# Altium project stm32f7board.PrjPcb (part 3 of 3)

## Sheet USB_OTG_HS_PHY.SchDoc
size A
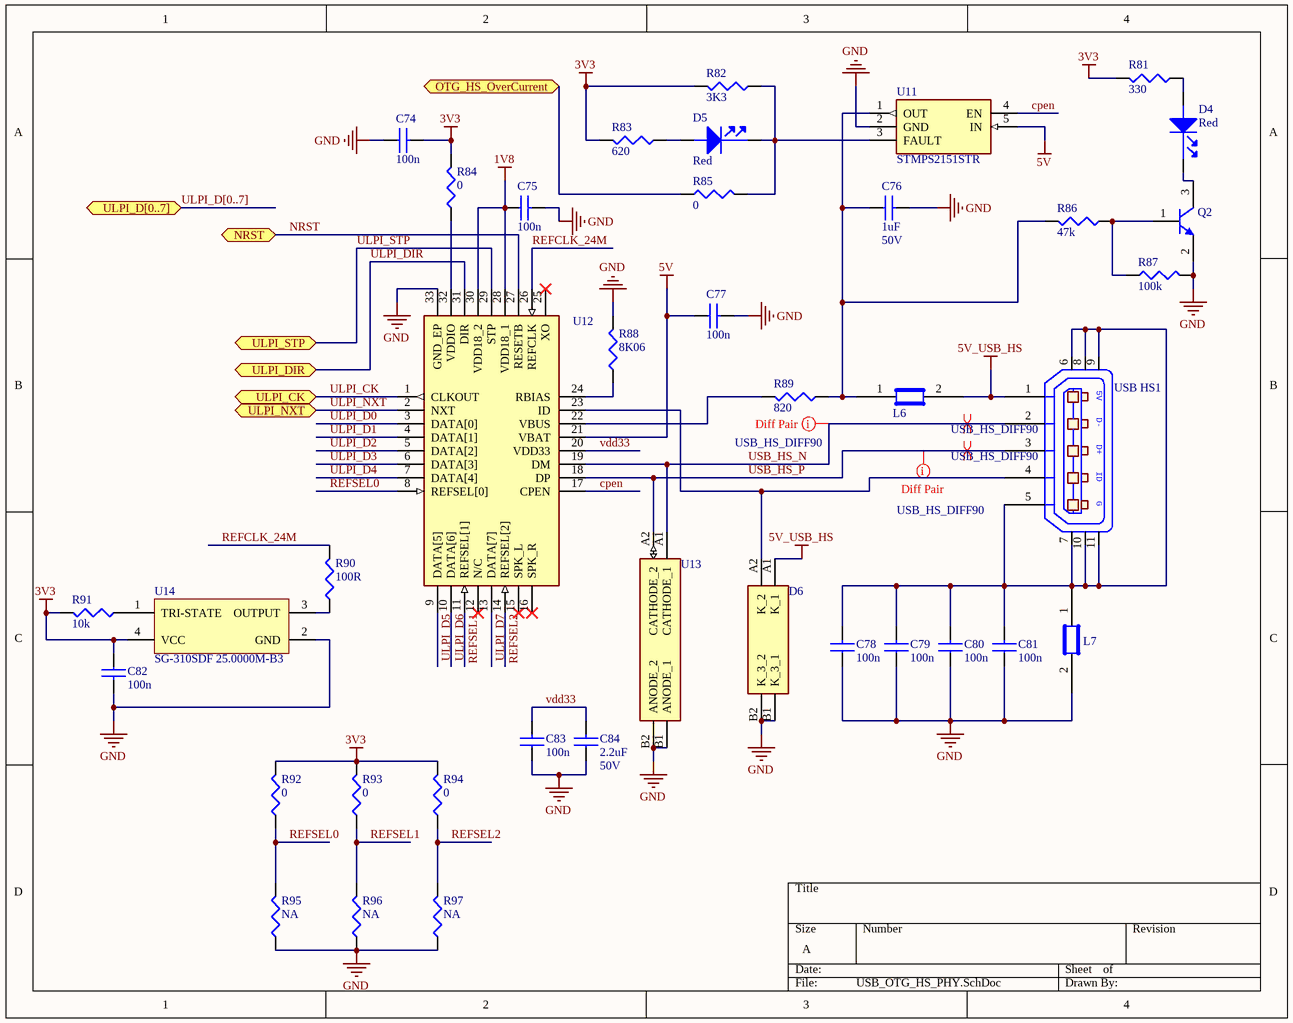
[diagram p11: USB_OTG_HS_PHY.SchDoc]

### Parts
C74  100n  [C0402]
C75  100n  [C0402]
C76  1uF  Voltage - Rated: 50V  [C0805]
C77  100n  [C0402]
C78  100n  [C0402]
C79  100n  [C0402]
C80  100n  [C0402]
C81  100n  [C0402]
C82  100n  [C0402]
C83  100n  [C0402]
C84  2.2uF  Voltage - Rated: 50V  [C0805]
D4  Red  [LED_0603]
D5  Red  [LED_0603]
D6  ESDA14V2-2BF3  [BGA4C40P2X2_77X77X66]  (value not drawn)
L6  MPZ1608S601A 600OHM/1A  [C0603]  (value not drawn)
L7  MPZ1608S601A 600OHM/1A  [C0603]  (value not drawn)
Q2  MMBT2222A-7-F  [DIOD-SOT23-3_V]  (value not drawn)
R81  330  [R0402]
R82  3K3  [R0402]
R83  620  [R0402]
R84  0  [R0402]
R85  0  [R0402]
R86  47k  [R0402]
R87  100k  [R0402]
R88  8K06  [R0402]
R89  820  [R0402]
R90  100R  [R0402]
R91  10k  [R0402]
R92  0  [R0402]
R93  0  [R0402]
R94  0  [R0402]
R95  NA  [R0402]
R96  NA  [R0402]
R97  NA  [R0402]
U11  STMPS2151STR  [SOT95P280X145-5N]
U12  USB3320C-EZK-TR  [QFN50P500X500X100-33N-D]  (value not drawn)
U13  USBULC6-2F3  [BGA4C40P2X2_82X82X66]  (value not drawn)
U14  SG-310SDF 25.0000M-B3  [EPSON-SG-310-4_V]
USB_HS1  USB MICRO AB  [USB_Micro_AB]  (value not drawn)

### Ports
NRST (bidir), OTG_HS_OverCurrent (bidir), ULPI_CK (bidir), ULPI_D[0..7] (bidir), ULPI_DIR (bidir), ULPI_NXT (bidir), ULPI_STP (bidir)

### Nets
1V8: C75.1 U12.28(VDD18_1) U12.30(VDD18_2)
3V3: C74.2 C82.1 R81.2 R82.2 R83.2 R84.2 R91.2 R92.2 R93.2 R94.2 U14.4(VCC)
5V: C77.1 U11.5(IN) U12.21(VBAT)
5V_USB_HS: D6.A1(K_1) L6.2 USB_HS1.1(P1)
GND: C74.1 C75.2 C76.2 C77.2 C78.1 C79.1 C80.1 C81.1 C82.2 C83.1 C84.1 D6.B1(K_3_1) D6.B2(K_3_2) L7.2 Q2.2(E) R87.2 R88.2 R95.1 R96.1 R97.1 U11.2(GND) U12.33(GND_EP) U13.B1(ANODE_1) U13.B2(ANODE_2) U14.2(GND)
cpen: U11.4(EN) U12.17(CPEN)
NRST: U12.27(RESETB) ; port NRST  [project net DCMI_NRST]
OTG_HS_OverCurrent: R85.1 ; port OTG_HS_OverCurrent
REFCLK_24M: R90.2 U12.26(REFCLK)
REFSEL0: R92.1 R95.2 U12.8(REFSEL[0])
REFSEL1: R93.1 R96.2 U12.11(REFSEL[1])
REFSEL2: R94.1 R97.2 U12.14(REFSEL[2])
ULPI_CK: U12.1(CLKOUT) ; port ULPI_CK
ULPI_D0: U12.3(DATA[0])
ULPI_D1: U12.4(DATA[1])
ULPI_D2: U12.5(DATA[2])
ULPI_D3: U12.6(DATA[3])
ULPI_D4: U12.7(DATA[4])
ULPI_D5: U12.9(DATA[5])
ULPI_D6: U12.10(DATA[6])
ULPI_D7: U12.13(DATA[7])
ULPI_DIR: U12.31(DIR) ; port ULPI_DIR
ULPI_NXT: U12.2(NXT) ; port ULPI_NXT
ULPI_STP: U12.29(STP) ; port ULPI_STP
USB_HS_N: U12.19(DM) U13.A1(CATHODE_1) USB_HS1.2(P2)
USB_HS_P: U12.18(DP) U13.A2(CATHODE_2) USB_HS1.3(P3)
vdd33: C83.2 C84.2 U12.20(VDD33)
NetC76_1: C76.1 L6.1 R86.2 R89.1 U11.1(OUT)
NetC78_2: C78.2 C79.2 C80.2 C81.2 L7.1 USB_HS1.5(P5) USB_HS1.6 USB_HS1.7 USB_HS1.8 USB_HS1.9 USB_HS1.10 USB_HS1.11
NetD4_1: D4.1(cathode) Q2.3(C)
NetD4_2: D4.2(ANODE) R81.1
NetD5_1: D5.1(cathode) R82.1 R85.2 U11.3(FAULT)
NetD5_2: D5.2(ANODE) R83.1
NetD6_A2: D6.A2(K_2) U12.23(ID) USB_HS1.4(P4)
NetQ2_1: Q2.1(B) R86.1 R87.1
NetR84_1: R84.1 U12.32(VDDIO)
NetR88_1: R88.1 U12.24(RBIAS)
NetR89_2: R89.2 U12.22(VBUS)
NetR90_1: R90.1 U14.3(OUTPUT)
NetR91_1: R91.1 U14.1(TRI-STATE)

Not connected (* = marked no-connect by the designer): U12 12(N/C)* 15(SPK_L)* 16(SPK_R)* 25(XO)*

### Buses and harness runs
bus ULPI_D[0..7] = port ULPI_D[0..7]

### Layout directives
differential pair; differential pair class USB_HS_DIFF90: USB_HS_N, USB_HS_P
net class USB_HS_DIFF90: USB_HS_N, USB_HS_P

### Notes on the sheet
- (in symbol 0475890001) 5V; D-; D+; ID; G

### Library data of the parts
C74 C75 C77-C83 = C1005X5R1H104K: CAP CER .10UF 50V X5R 10% 0402; Manufacturer: TDK Corporation; Capacitance: 0.1µF; Value: 100nF; .Checked PCB: used; Category: Capacitors; Supplier Part Number: 445-5942-1-ND; Manufacturer Part Number: C1005X5R1H104K; Operating Temperature: -55°C ~ 85°C; Package / Case: 0402 (1005 Metric); Price 1k [$]: 0.02340; .Checked SCH: used; Voltage - Rated: 50V; Supplier: Digikey; Supplier 1: Digi-Key; Supplier Part Number 1: 445-5942-1-ND; RoHS: RoHS Compliant; Stock 1: 106926; Pricing 1: 1=0.27, 10=0.18, 100=0.072, 250=0.05176, 500=0.0369, 1000=0.027 (USD); Tolerance: ±10%; Temperature Coefficient: X5R; Mounting Type: Surface Mount, MLCC; Applications: General Purpose; Ratings: -; Size / Dimension: 0.039" L x 0.020" W (1.00mm x 0.50mm); Height - Seated (Max): -; Thickness (Max): 0.022" (0.55mm); Lead Spacing: -; Features: -; Packaging: Cut Tape (CT); Lead Style: -; ComponentLink1URL: http://www.tdk.co.jp/tefe02/e412_c.pdf; ComponentLink1Description: http://www.tdk.co.jp/tefe02/e412_c.pdf
C76 C84 = GRM21BR71H105KA12L: CAP CER 1UF 50V X7R 0805; Manufacturer: Murata Electronics North America; Capacitance: 1.0µF; .Checked PCB: used; Tolerance: ±10%; Category: Capacitors; Manufacturer Part Number: GRM21BR71H105KA12L; Operating Temperature: -55°C ~ 125°C; Package / Case: 0805 (2012 Metric); Price 1k [$]: 0.1359; Value: 1uF; .Checked SCH: used; Supplier Part Number: 490-4736-1-ND; Supplier: Digikey; Supplier 1: Digi-Key; Supplier Part Number 1: 490-4736-1-ND; RoHS: RoHS Compliant; Stock 1: 422791; Pricing 1: 1=0.28, 10=0.254, 25=0.226, 50=0.1978, 100=0.1836, 250=0.16952, 500=0.16102, 750=0.14691, 1000=0.12995 (USD); Temperature Coefficient: X7R; Mounting Type: Surface Mount, MLCC; Applications: General Purpose; Ratings: -; Size / Dimension: 0.079" L x 0.049" W (2.00mm x 1.25mm); Height - Seated (Max): -; Thickness (Max): 0.053" (1.35mm); Lead Spacing: -; Features: -; Packaging: Cut Tape (CT); Lead Style: -; ComponentLink1URL: http://search.murata.co.jp/Ceramy/image/img/PDF/ENG/GRM21BR71H105KA12.pdf; ComponentLink1Description: http://search.murata.co.jp/Ceramy/image/img/PDF/ENG/GRM21BR71H105KA12.pdf
D4 D5 = LS L29K-H1J2-1-Z: LED SMARTLED RED 630NM 0603 SMD; Manufacturer: OSRAM Opto Semiconductors Inc; Millicandela Rating: 4.95mcd; Voltage - Forward (Vf) Typ: 1.8V; Current - Test: 2mA; Wavelength - Peak: 643nm; Viewing Angle: 160°; Lens Type: Diffused; Lens Style/Size: Rectangle with Flat Top, 1.3mm x 0.8mm; Luminous Flux @ Current - Test: 20 mlm; .Checked PCB: RF; Supplier 1: Digi-Key; Supplier Part Number 1: 475-1195-1-ND; Manufacturer Part Number: LS L29K-H1J2-1-Z; RoHS: RoHS Compliant; Category: Optoelectronics; Stock 1: 71670; Pricing 1: 1=0.16, 10=0.137, 100=0.1093, 250=0.09564, 500=0.08744 (USD); Color: Red; Wavelength - Dominant: 630nm; Package / Case: 0603 (1608 Metric); Size / Dimension: 1.70mm L x 0.80mm W; Height: 0.65mm; Mounting Type: Surface Mount; Packaging: Cut Tape (CT); ComponentLink1URL: http://catalog.osram-os.com/catalogue/catalogue.do;jsessionid=DB7CFDBAC5AF1E216E45F622E867085A?act=downloadFile&favOid=020000010003f9de000100b6; ComponentLink1Description: http://catalog.osram-os.com/catalogue/catalogue.do;jsessionid=DB7CFDBAC5AF1E216E45F622E867085A?act=downloadFile&favOid=020000010003f9de000100b6; .Checked SCH: RF
D6 = ESDA14V2-2BF3: TVS Diode (Bi-directional); Manufacturer_Name: STMicroelectronics; Datasheet Link: https://mouser.componentsearchengine.com/Datasheets/1/ESDA14V2-2BF3.pdf; Height: 0.66mm; Manufacturer_Part_Number: ESDA14V2-2BF3; Mouser Part Number: 511-ESDA14V2-2BF3; Mouser Price/Stock: https://www.mouser.com/Search/Refine.aspx?Keyword=511-ESDA14V2-2BF3
L6 L7 = MPZ1608S601A: FERRITE CHIP BEAD 600 OHM SMD 1A; Manufacturer: TDK Corporation; Impedance @ Frequency: 600 Ohm @ 100MHz; DC Resistance (DCR): 150 mOhm Max; Filter Type: Differential Mode - Single; Number of Lines: 1; .Checked PCB: RF; Supplier 1: Digi-Key; Supplier Part Number 1: 445-2205-1-ND; Manufacturer Part Number: MPZ1608S601A; RoHS: RoHS Compliant; Category: Filters; Stock 1: 328345; Pricing 1: 1=0.36, 10=0.24, 100=0.096, 250=0.069, 500=0.0492, 1000=0.036 (USD); Current Rating: 1A; Package / Case: 0603 (1608 Metric); Mounting Type: Surface Mount; Packaging: Cut Tape (CT); Height (Max): 0.037" (0.95mm); Size / Dimension: 0.063" L x 0.031" W (1.60mm x 0.80mm); ComponentLink1URL: http://www.tdk.co.jp/tefe02/e9413_mpz.pdf; ComponentLink1Description: http://www.tdk.co.jp/tefe02/e9413_mpz.pdf; .Checked SCH: RF
Q2 = CMP-1693-00003-1: NPN Small Signal Transistor, 40 V, -55 to 150 degC, 3-Pin SOT23, RoHS, Tape and Reel; Manufacturer: Diodes Inc; ComponentLink1URL: http://www.diodes.com/; ComponentLink2Description: Datasheet; PackageReference: SOT23-3; PartNumber: MMBT2222A-7-F; ComponentLink1Description: Manufacturer URL; ComponentLink2URL: http://www.diodes.com/_files/datasheets/ds30041.pdf; PackageDescription: 3-Pin Small Outline Transistor, Body 2.9 x 1.3 mm, Pitch 0.95 mm; DatasheetVersion: Rev. 16 - 2; Mounting Technology: Surface Mount
R81 R83 R89 = RC0402FR-0710KL: RES 10.0K OHM 1/16W 1% 0402 SMD; Manufacturer: Yageo; Resistance (Ohms): 10K; Power (Watts): 0.063W, 1/16W; Value: 10k; .Checked PCB: used; Temperature Coefficient: ±100ppm/°C; Category: Resistors; Supplier Part Number: 311-10.0KLRCT-ND; Manufacturer Part Number: RC0402FR-0710KL; Package / Case: 0402 (1005 Metric); Price 1k [$]: 0.01421; Tolerance: ±1%; .Checked SCH: used; Supplier: Digikey; Supplier 1: Digi-Key; Supplier Part Number 1: 311-10.0KLRCT-ND; RoHS: RoHS Compliant; Stock 1: 2916495; Pricing 1: 10=0.014, 50=0.0104, 100=0.0079, 250=0.00584, 500=0.00432, 1000=0.00288 (USD); Composition: Thick Film; Features: -; Size / Dimension: 0.039" L x 0.020" W (1.00mm x 0.50mm); Height: 0.016" (0.40mm); Number of Terminations: 2; Packaging: Cut Tape (CT); ComponentLink1URL: http://www.yageo.com/documents/recent/PYu-RC0402_51_RoHS_L_6.pdf; ComponentLink1Description: http://www.yageo.com/documents/recent/PYu-RC0402_51_RoHS_L_6.pdf
R82 R88 = RC0402FR-0710KL: RES 10.0K OHM 1/16W 1% 0402 SMD; Manufacturer: Yageo; Resistance (Ohms): 47k; Power (Watts): 0.063W, 1/16W; Value: 47k; .Checked PCB: used; Temperature Coefficient: ±100ppm/°C; Category: Resistors; Supplier Part Number: 311-10.0KLRCT-ND; Manufacturer Part Number: RC0402FR-0710KL; Package / Case: 0402 (1005 Metric); Price 1k [$]: 0.01421; Tolerance: ±1%; .Checked SCH: used; Supplier: Digikey; Supplier 1: Digi-Key; Supplier Part Number 1: 311-10.0KLRCT-ND; RoHS: RoHS Compliant; Stock 1: 2916495; Pricing 1: 10=0.014, 50=0.0104, 100=0.0079, 250=0.00584, 500=0.00432, 1000=0.00288 (USD); Composition: Thick Film; Features: -; Size / Dimension: 0.039" L x 0.020" W (1.00mm x 0.50mm); Height: 0.016" (0.40mm); Number of Terminations: 2; Packaging: Cut Tape (CT); ComponentLink1URL: http://www.yageo.com/documents/recent/PYu-RC0402_51_RoHS_L_6.pdf; ComponentLink1Description: http://www.yageo.com/documents/recent/PYu-RC0402_51_RoHS_L_6.pdf
R84 R85 R92-R97 = RC0402FR-07100RL: RES 100 OHM 1/16W 1% 0402 SMD; Manufacturer: Yageo; Resistance (Ohms): 100; Power (Watts): 0.063W, 1/16W; Value: 100R; .Checked PCB: RF; Temperature Coefficient: ±100ppm/°C; Category: Resistors; Supplier Part Number: 311-100LRCT-ND; Manufacturer Part Number: RC0402FR-07100RL; Package / Case: 0402 (1005 Metric); Price 1k [$]: 0.01421; Tolerance: ±1%; .Checked SCH: RF; Supplier: Digikey; Supplier 1: Digi-Key; Supplier Part Number 1: 311-100LRCT-ND; RoHS: RoHS Compliant; Stock 1: 1682040; Pricing 1: 10=0.014, 50=0.0104, 100=0.0079, 250=0.00584, 500=0.00432, 1000=0.00288 (USD); Composition: Thick Film; Features: -; Size / Dimension: 0.039" L x 0.020" W (1.00mm x 0.50mm); Height: 0.016" (0.40mm); Number of Terminations: 2; Packaging: Cut Tape (CT); ComponentLink1URL: http://www.yageo.com/documents/recent/PYu-RC0402_51_RoHS_L_6.pdf; ComponentLink1Description: http://www.yageo.com/documents/recent/PYu-RC0402_51_RoHS_L_6.pdf
R86 R91 = RC0402FR-0710KL: RES 10.0K OHM 1/16W 1% 0402 SMD; Manufacturer: Yageo; Power (Watts): 0.063W, 1/16W; .Checked PCB: used; Temperature Coefficient: ±100ppm/°C; Category: Resistors; Supplier Part Number: 311-10.0KLRCT-ND; Manufacturer Part Number: RC0402FR-0710KL; Package / Case: 0402 (1005 Metric); Price 1k [$]: 0.01421; Tolerance: ±1%; .Checked SCH: used; Supplier: Digikey; Supplier 1: Digi-Key; Supplier Part Number 1: 311-10.0KLRCT-ND; RoHS: RoHS Compliant; Stock 1: 2916495; Pricing 1: 10=0.014, 50=0.0104, 100=0.0079, 250=0.00584, 500=0.00432, 1000=0.00288 (USD); Composition: Thick Film; Features: -; Size / Dimension: 0.039" L x 0.020" W (1.00mm x 0.50mm); Height: 0.016" (0.40mm); Number of Terminations: 2; Packaging: Cut Tape (CT); ComponentLink1URL: http://www.yageo.com/documents/recent/PYu-RC0402_51_RoHS_L_6.pdf; ComponentLink1Description: http://www.yageo.com/documents/recent/PYu-RC0402_51_RoHS_L_6.pdf
  R86: Resistance (Ohms): 47k; Value: 47k
  R91: Resistance (Ohms): 10K; Value: 10k
R87 = RMCF0402FT100K: RES 100K OHM 1/16W 1% 0402 SMD; Manufacturer: Stackpole Electronics Inc; Power (Watts): 0.063W, 1/16W; .Checked PCB: used; Temperature Coefficient: ±100ppm/°C; Category: Resistors; Supplier Part Number: RMCF0402FT100KCT-ND; Manufacturer Part Number: RMCF0402FT100K; Package / Case: 0402 (1005 Metric); Price 1k [$]: 0.00384; Resistance (Ohms): 100K; Tolerance: ±1%; Value: 100k; .Checked SCH: used; Supplier: Digikey; Supplier 1: Digi-Key; Supplier Part Number 1: RMCF0402FT100KCT-ND; RoHS: RoHS Compliant; Stock 1: 95; Pricing 1: 1=0.04, 10=0.025, 50=0.0138, 100=0.0105, 250=0.0078, 500=0.00576, 1000=0.00384 (USD); Composition: Thick Film; Features: -; Size / Dimension: 0.039" L x 0.020" W (1.00mm x 0.50mm); Height: 0.016" (0.40mm); Number of Terminations: 2; Packaging: Cut Tape (CT); ComponentLink1URL: http://www.seielect.com/Catalog/SEI-RMCF.pdf; ComponentLink1Description: http://www.seielect.com/Catalog/SEI-RMCF.pdf
R90 = RC0402FR-07100RL: RES 100 OHM 1/16W 1% 0402 SMD; Manufacturer: Yageo; Resistance (Ohms): 100; Power (Watts): 0.063W, 1/16W; .Checked PCB: RF; Temperature Coefficient: ±100ppm/°C; Category: Resistors; Supplier Part Number: 311-100LRCT-ND; Manufacturer Part Number: RC0402FR-07100RL; Package / Case: 0402 (1005 Metric); Price 1k [$]: 0.01421; Tolerance: ±1%; Value: 100R; .Checked SCH: RF; Supplier: Digikey; Supplier 1: Digi-Key; Supplier Part Number 1: 311-100LRCT-ND; RoHS: RoHS Compliant; Stock 1: 1682040; Pricing 1: 10=0.014, 50=0.0104, 100=0.0079, 250=0.00584, 500=0.00432, 1000=0.00288 (USD); Composition: Thick Film; Features: -; Size / Dimension: 0.039" L x 0.020" W (1.00mm x 0.50mm); Height: 0.016" (0.40mm); Number of Terminations: 2; Packaging: Cut Tape (CT); ComponentLink1URL: http://www.yageo.com/documents/recent/PYu-RC0402_51_RoHS_L_6.pdf; ComponentLink1Description: http://www.yageo.com/documents/recent/PYu-RC0402_51_RoHS_L_6.pdf
U11 = STMPS2151STR: Integrated Circuit; Manufacturer_Name: STMicroelectronics; Datasheet Link: http://docs-emea.rs-online.com/webdocs/140d/0900766b8140da90.pdf; Height: 1.45mm; Manufacturer_Part_Number: STMPS2151STR; Mouser Part Number: 511-STMPS2151STR; Mouser Price/Stock: https://www.mouser.com/Search/Refine.aspx?Keyword=511-STMPS2151STR; RS Part Number: 8805415P; RS Price/Stock: http://uk.rs-online.com/web/p/products/8805415P
U12 = USB3320C-EZK-TR: Integrated Circuit; Manufacturer_Name: Microchip; Allied_Number: 70547390; Datasheet Link: http://ww1.microchip.com/downloads/en/DeviceDoc/00001792B.pdf; Height: 1mm; Manufacturer_Part_Number: USB3320C-EZK-TR; Mouser Part Number: 886-USB3320C-EZK-TR; Mouser Price/Stock: https://www.mouser.com/Search/Refine.aspx?Keyword=886-USB3320C-EZK-TR; RS Part Number: 8246295P; RS Price/Stock: http://uk.rs-online.com/web/p/products/8246295P; Allied Price/Stock: http://www.alliedelec.com/microchip-technology-inc-usb3320c-ezk-tr/70547390/
U13 = USBULC6-2F3: Integrated Circuit; Manufacturer_Name: STMicroelectronics; Datasheet Link: https://static6.arrow.com/aropdfconversion/e8c02f582128879890acd9053f17881726c2e8f3/806737430326407cd00147797.pdf; Height: 0.66mm; Manufacturer_Part_Number: USBULC6-2F3; Mouser Part Number: 511-USBULC6-2F3; Mouser Price/Stock: https://www.mouser.com/Search/Refine.aspx?Keyword=511-USBULC6-2F3
U14 = CMP-1695-00002-3: Crystal Oscillator (SPXO), 2.5 V, 25 MHz, -20 to 70 degC, 4-Pin SMD, RoHS, Tape and Reel; ComponentLink2URL: http://www5.epsondevice.com/en/products/spxo_standard/sg310sdf.html#; DatasheetVersion: Rev. Feb-15; ComponentLink1Description: Manufacturer URL; ComponentLink1URL: https://www.eea.epson.com/; Mounting Technology: Surface Mount; PartNumber: SG-310SDF 25.0000M-B3; PackageDescription: 4-Pin Surface Mount Device, Body 3.2 x 2.5 mm; ComponentLink2Description: Datasheet; Max Operating Temperature: 70 degC; Length: 3.2 mm; Packaging: Tape and Reel; Height: 1.05 mm; RoHSCompliant: True; Min Operating Temperature: -20 degC; Width: 2.5 mm
USB_HS1 = 0475890001: CONN RCPT MICRO USB AB R/A SMD; Manufacturer: Molex Inc; Connector Type: USB - micro AB; Number of Contacts: 5; Gender: Receptacle; .Creator: MM; Supplier 1: Digi-Key; Manufacturer Part Number: 0475890001; RoHS: RoHS Compliant; Category: Connectors, Interconnects; Stock 1: 12754; Pricing 1: 1=0.81, 10=0.764, 25=0.6872, 50=0.6108, 100=0.5854, 250=0.53452, 500=0.50908 (USD); Packaging: Cut Tape (CT); Specifications: -; Mounting Type: Surface Mount, Right Angle, Horizontal; Features: Board Guide, Shielded; Ingress Protection: -; ComponentLink1URL: http://www.molex.com/pdm_docs/sd/475890001_sd.pdf; ComponentLink1Description: http://www.molex.com/pdm_docs/sd/475890001_sd.pdf; Supplier Part Number 1: WM17143CT-ND; .Checked PCB: MM; .Checked SCH: MM

## Sheet gpio.SchDoc
size A
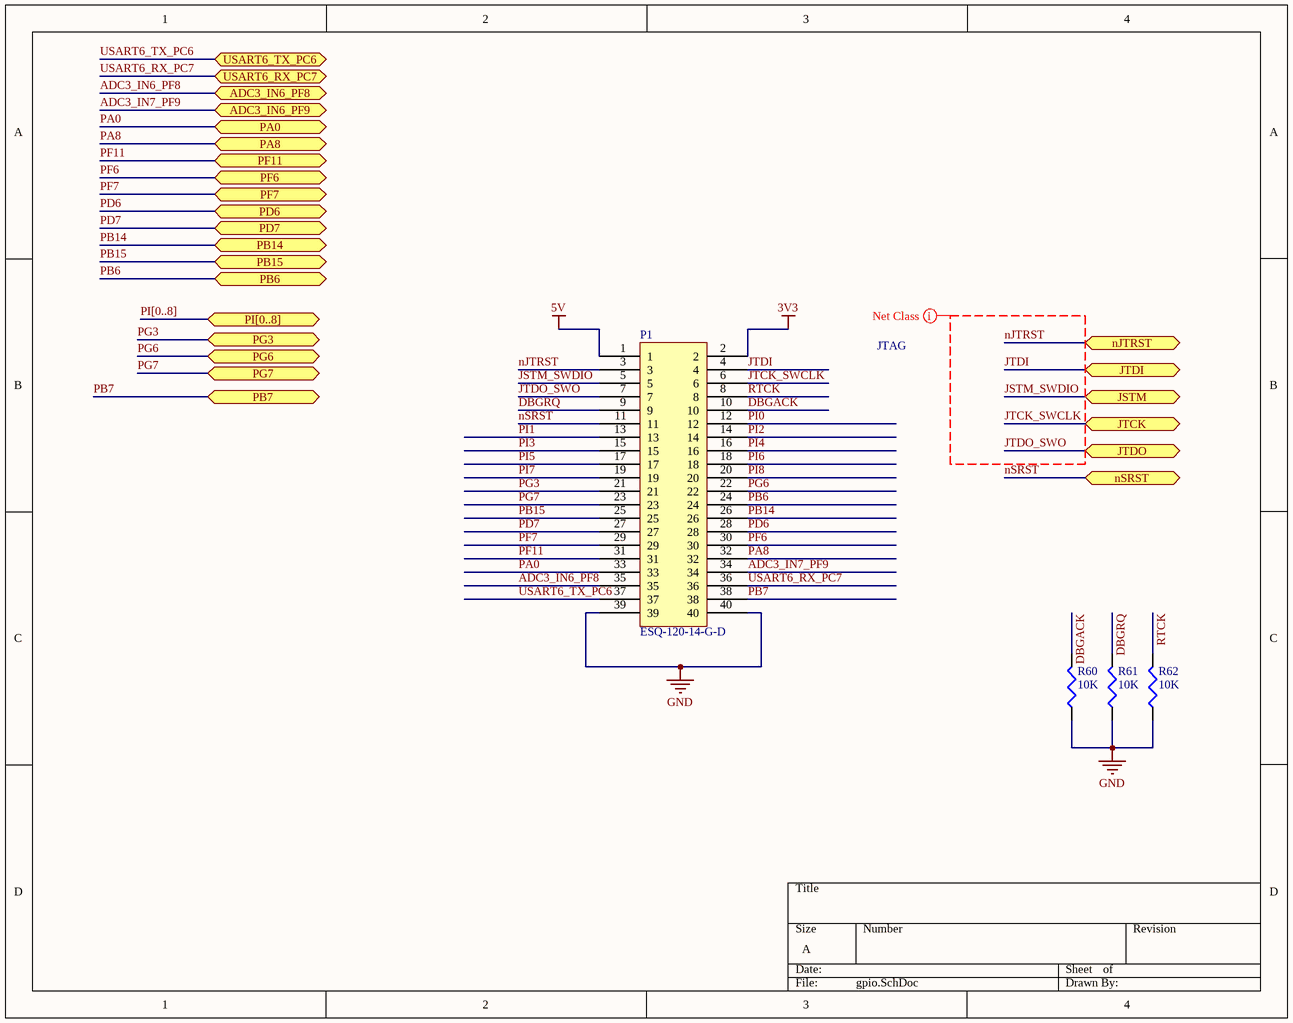
[diagram p12: gpio.SchDoc]

### Parts
P1  ESQ-120-14-G-D  [PBD40]
R60  10K  [R0402]
R61  10K  [R0402]
R62  10K  [R0402]

### Ports
ADC3_IN6_PF8 (bidir), ADC3_IN6_PF9 (bidir), JSTM (bidir), JTCK (bidir), JTDI (bidir), JTDO (bidir), nJTRST (bidir), nSRST (bidir), PA0 (bidir), PA8 (bidir), PB6 (bidir), PB7 (bidir), PB14 (bidir), PB15 (bidir), PD6 (bidir), PD7 (bidir), PF6 (bidir), PF7 (bidir), PF11 (bidir), PG3 (bidir), PG6 (bidir), PG7 (bidir), PI[0..8] (bidir), USART6_RX_PC7 (bidir), USART6_TX_PC6 (bidir)

### Nets
3V3: P1.2
5V: P1.1
GND: P1.39 P1.40 R60.1 R61.1 R62.1
ADC3_IN6_PF8: P1.35 ; port ADC3_IN6_PF8
ADC3_IN7_PF9: P1.34 ; port ADC3_IN6_PF9
DBGACK: P1.10 R60.2
DBGRQ: P1.9 R61.2
JSTM_SWDIO: P1.5 ; port JSTM
JTCK_SWCLK: P1.6 ; port JTCK
JTDI: P1.4 ; port JTDI
JTDO_SWO: P1.7 ; port JTDO
nJTRST: P1.3 ; port nJTRST
nSRST: P1.11 ; port nSRST  [project net DCMI_NRST]
PA0: P1.33 ; port PA0
PA8: P1.32 ; port PA8
PB6: P1.24 ; port PB6
PB7: P1.38 ; port PB7
PB14: P1.26 ; port PB14
PB15: P1.25 ; port PB15
PD6: P1.28 ; port PD6
PD7: P1.27 ; port PD7
PF6: P1.30 ; port PF6
PF7: P1.29 ; port PF7
PF11: P1.31 ; port PF11
PG3: P1.21 ; port PG3
PG6: P1.22 ; port PG6
PG7: P1.23 ; port PG7
PI0: P1.12
PI1: P1.13
PI2: P1.14
PI3: P1.15
PI4: P1.16
PI5: P1.17
PI6: P1.18
PI7: P1.19
PI8: P1.20
RTCK: P1.8 R62.2
USART6_RX_PC7: P1.36 ; port USART6_RX_PC7
USART6_TX_PC6: P1.37 ; port USART6_TX_PC6

### Buses and harness runs
bus PI[0..8] = port PI[0..8]

### Layout directives
net class JTAG: JSTM_SWDIO, JTCK_SWCLK, JTDI, JTDO_SWO, nJTRST

### Library data of the parts
P1 = ESQ-120-14-G-D: CONN RCPT 40POS .100" DUAL GOLD; Manufacturer: Samtec Inc.; Connector Type: Receptacle; Number of Positions: 40; Number of Positions Loaded: All; Pitch: 0.100" (2.54mm); .Creator: MM; Supplier 1: Digi-Key; Manufacturer Part Number: ESQ-120-14-G-D; RoHS: RoHS Compliant; Category: Connectors, Interconnects; Stock 1: 51; Pricing 1: 1=7.42, 10=6.864, 50=6.1586, 100=5.7505, 250=5.00852, 500=4.823, 1000=4.6375, 2500=4.452 (USD); Packaging: Tube; Contact Type: Female Socket; Number of Rows: 2; Row Spacing: 0.100" (2.54mm); Mounting Type: Through Hole; Termination: Solder; Fastening Type: -; Features: -; Contact Finish: Gold; Contact Finish Thickness: 20µin (0.51µm); Color: Black; ComponentLink1URL: http://suddendocs.samtec.com/prints/esq-1xx-xx-x-x-xxx-xx-x-xx-mkt.pdf; ComponentLink1Description: http://suddendocs.samtec.com/prints/esq-1xx-xx-x-x-xxx-xx-x-xx-mkt.pdf; Supplier Part Number 1: SAM8767-ND; .Checked PCB: MM; .Checked SCH: MM
R60-R62 = RC0402FR-07100RL: as R84 on sheet USB_OTG_HS_PHY; Category: Resistors; Supplier Part Number: 311-100LRCT-ND; Manufacturer Part Number: RC0402FR-07100RL; Package / Case: 0402 (1005 Metric); Price 1k [$]: 0.01421; Tolerance: ±1%; .Checked SCH: RF; Supplier: Digikey; Supplier 1: Digi-Key; Supplier Part Number 1: 311-100LRCT-ND; RoHS: RoHS Compliant; Stock 1: 1682040; Pricing 1: 10=0.014, 50=0.0104, 100=0.0079, 250=0.00584, 500=0.00432, 1000=0.00288 (USD); Composition: Thick Film; Features: -; Size / Dimension: 0.039" L x 0.020" W (1.00mm x 0.50mm); Height: 0.016" (0.40mm); Number of Terminations: 2; Packaging: Cut Tape (CT); ComponentLink1URL: http://www.yageo.com/documents/recent/PYu-RC0402_51_RoHS_L_6.pdf; ComponentLink1Description: http://www.yageo.com/documents/recent/PYu-RC0402_51_RoHS_L_6.pdf

## Nets that join several sheets
1V8: ps (C53.1 U5.2), USB_OTG_HS_PHY (C75.1 U12.28 U12.30)
3V3: cpu (5 pins), ps (5 pins), Ethernet_PHY_RJ45 (14 pins), SDRAM (28 pins), quad_spi_flash (C54.2 R37.2 U6.8), cpuPower (43 pins), Lcd_CapTouch (5 pins), SD_CARD (8 pins), Camera (7 pins), USB_OTG_FS (D2.2 R70.2 R72.2 R79.1), USB_OTG_HS_PHY (11 pins), gpio (P1.2)
5V: ps (C49.1 C50.1 Power1.1 U4.1), USB_OTG_FS (U9.5), USB_OTG_HS_PHY (C77.1 U11.5 U12.21), gpio (P1.1)
GND: cpu (11 pins), ps (10 pins), Ethernet_PHY_RJ45 (25 pins), SDRAM (46 pins), quad_spi_flash (C54.1 U6.4), cpuPower (45 pins), Lcd_CapTouch (8 pins), SD_CARD (7 pins), Camera (9 pins), USB_OTG_FS (7 pins), USB_OTG_HS_PHY (25 pins), gpio (5 pins)
ADC3_IN6_PF8: cpu (U1.L3), gpio (P1.35)
ADC3_IN7_PF9: cpu (U1.L2), gpio (P1.34)
DCMI_D0: cpu (U1.N14), Camera (CAM1.4)
DCMI_D1: cpu (U1.P15), Camera (CAM1.5)
DCMI_D2: cpu (U1.N15), Camera (CAM1.6)
DCMI_D3: cpu (U1.M15), Camera (CAM1.7)
DCMI_D4: cpu (U1.E13), Camera (CAM1.8)
DCMI_D5: cpu (U1.C11), Camera (CAM1.9)
DCMI_D6: cpu (U1.B1), Camera (CAM1.10)
DCMI_D7: cpu (U1.B2), Camera (CAM1.11)
DCMI_HSYNC: cpu (U1.N4), Camera (CAM1.17)
DCMI_NRST: cpu (R10.1 U1.J1), Ethernet_PHY_RJ45 (U2.15), cpuPower (C7.1 R11.1 Reset1.1), Lcd_CapTouch (TFT1.37), Camera (CAM1.26), USB_OTG_HS_PHY (U12.27), gpio (P1.11)
DCMI_PIXCK: cpu (U1.P3), Camera (CAM1.15)
DCMI_PWR_EN: cpu (U1.E12), Camera (CAM1.25)
DCMI_SCL: cpu (R1.1 U1.A7), Camera (R58.1)
DCMI_SDA: cpu (R2.1 U1.B4), Camera (R59.1)
DCMI_VSYNC: cpu (U1.D9), Camera (CAM1.19)
FMC_A0: cpu (U1.D2), SDRAM (U7.G8)
FMC_A1: cpu (U1.E2), SDRAM (U7.G9)
FMC_A2: cpu (U1.G2), SDRAM (U7.F7)
FMC_A3: cpu (U1.H2), SDRAM (U7.F3)
FMC_A4: cpu (U1.J2), SDRAM (U7.G1)
FMC_A5: cpu (U1.K3), SDRAM (U7.G2)
FMC_A6: cpu (U1.M6), SDRAM (U7.G3)
FMC_A7: cpu (U1.N6), SDRAM (U7.H1)
FMC_A8: cpu (U1.P6), SDRAM (U7.H2)
FMC_A9: cpu (U1.M8), SDRAM (U7.J3)
FMC_A10: cpu (U1.N7), SDRAM (U7.G7)
FMC_A11: cpu (U1.M7), SDRAM (U7.H9)
FMC_BA0: cpu (U1.N12), SDRAM (U7.J7)
FMC_BA1: cpu (U1.N11), SDRAM (U7.H8)
FMC_D0: cpu (U1.L12), SDRAM (U7.R8)
FMC_D1: cpu (U1.K13), SDRAM (U7.N7)
FMC_D2: cpu (U1.B12), SDRAM (U7.R9)
FMC_D3: cpu (U1.C12), SDRAM (U7.N8)
FMC_D4: cpu (U1.R8), SDRAM (U7.P9)
FMC_D5: cpu (U1.N9), SDRAM (U7.M8)
FMC_D6: cpu (U1.P9), SDRAM (U7.M7)
FMC_D7: cpu (U1.R9), SDRAM (U7.L8)
FMC_D8: cpu (U1.P10), SDRAM (U7.L2)
FMC_D9: cpu (U1.R10), SDRAM (U7.M3)
FMC_D10: cpu (U1.R12), SDRAM (U7.M2)
FMC_D11: cpu (U1.P11), SDRAM (U7.P1)
FMC_D12: cpu (U1.R11), SDRAM (U7.N2)
FMC_D13: cpu (U1.L15), SDRAM (U7.R1)
FMC_D14: cpu (U1.L14), SDRAM (U7.N3)
FMC_D15: cpu (U1.K15), SDRAM (U7.R2)
FMC_NBL0: cpu (U1.A6), SDRAM (U7.K9)
FMC_NBL1: cpu (U1.A5), SDRAM (U7.K1)
FMC_SDCKE0: cpu (U1.L4), SDRAM (U7.J2)
FMC_SDCLK: cpu (U1.H14), SDRAM (U7.J1)
FMC_SDNCAS: cpu (U1.B7), SDRAM (U7.K7)
FMC_SDNE0: cpu (U1.J4), SDRAM (U7.J8)
FMC_SDNRAS: cpu (U1.L1), SDRAM (U7.J9)
FMC_SDNWE: cpu (U1.J3), SDRAM (U7.K8)
JSTM_SWDIO: cpu (U1.A15), gpio (P1.5)
JTCK_SWCLK: cpu (U1.A14), gpio (P1.6)
JTDI: cpu (U1.A13), gpio (P1.4)
JTDO_SWO: cpu (U1.A10), gpio (P1.7)
LCD_B0: cpu (U1.A1), Lcd_CapTouch (TFT1.21)
LCD_B1: cpu (U1.B9), Lcd_CapTouch (TFT1.22)
LCD_B2: cpu (U1.C9), Lcd_CapTouch (TFT1.23)
LCD_B3: cpu (U1.D10), Lcd_CapTouch (TFT1.24)
LCD_B4: cpu (U1.C7), Lcd_CapTouch (TFT1.25)
LCD_B5: cpu (U1.D7), Lcd_CapTouch (TFT1.26)
LCD_B6: cpu (U1.C6), Lcd_CapTouch (TFT1.27)
LCD_B7: cpu (U1.C5), Lcd_CapTouch (TFT1.28)
LCD_BL_CTRL: cpu (U1.D8), Lcd_CapTouch (R33.1)
LCD_CLK: cpu (U1.H3), Lcd_CapTouch (TFT1.30)
LCD_DE: cpu (U1.C4), Lcd_CapTouch (TFT1.34)
LCD_DISP: cpu (U1.E3), Lcd_CapTouch (R35.1 TFT1.31)
LCD_G0: cpu (U1.J12), Lcd_CapTouch (TFT1.13)
LCD_G1: cpu (U1.H12), Lcd_CapTouch (TFT1.14)
LCD_G2: cpu (U1.J13), Lcd_CapTouch (TFT1.15)
LCD_G3: cpu (U1.H13), Lcd_CapTouch (TFT1.16)
LCD_G4: cpu (U1.G12), Lcd_CapTouch (TFT1.17)
LCD_G5: cpu (U1.G13), Lcd_CapTouch (TFT1.18)
LCD_G6: cpu (U1.F12), Lcd_CapTouch (TFT1.19)
LCD_G7: cpu (U1.F13), Lcd_CapTouch (TFT1.20)
LCD_HSYNC: cpu (U1.D5), Lcd_CapTouch (TFT1.32)
LCD_INT: cpu (U1.G3), Lcd_CapTouch (TFT1.38)
LCD_R0: cpu (U1.G4), Lcd_CapTouch (TFT1.5)
LCD_R1: cpu (U1.R6), Lcd_CapTouch (TFT1.6)
LCD_R2: cpu (U1.R7), Lcd_CapTouch (TFT1.7)
LCD_R3: cpu (U1.P7), Lcd_CapTouch (TFT1.8)
LCD_R4: cpu (U1.N8), Lcd_CapTouch (TFT1.9)
LCD_R5: cpu (U1.M9), Lcd_CapTouch (TFT1.10)
LCD_R6: cpu (U1.M14), Lcd_CapTouch (TFT1.11)
LCD_R7: cpu (U1.K12), Lcd_CapTouch (TFT1.12)
LCD_SCL: cpu (U1.N13), Lcd_CapTouch (TFT1.39)
LCD_SDA: cpu (U1.P14), Lcd_CapTouch (TFT1.40)
LCD_VSYNC: cpu (U1.E4), Lcd_CapTouch (TFT1.33)
nJTRST: cpu (U1.A9), gpio (P1.3)
OTG_FS_ID: cpu (U1.D15), USB_OTG_FS (R77.1)
OTG_FS_N: cpu (U1.C15), USB_OTG_FS (R75.1 U10.D3)
OTG_FS_OverCurrent: cpu (U1.D11), USB_OTG_FS (R71.2)
OTG_FS_P: cpu (U1.B15), USB_OTG_FS (R76.1 U10.C3)
OTG_FS_PowerSwitchOn: cpu (U1.C10), USB_OTG_FS (R74.1)
OTG_FS_VBUS: cpu (R3.1), USB_OTG_FS (5 pins)
OTG_HS_OverCurrent: cpu (U1.A2), USB_OTG_HS_PHY (R85.1)
PA0: cpu (U1.N3), gpio (P1.33)
PA8: cpu (U1.F15), gpio (P1.32)
PB6: cpu (U1.B6), quad_spi_flash (R37.1 U6.1), gpio (P1.24)
PB7: cpu (U1.B5), gpio (P1.38)
PB14: cpu (U1.R14), gpio (P1.26)
PB15: cpu (U1.R15), gpio (P1.25)
PD6: cpu (U1.B11), gpio (P1.28)
PD7: cpu (U1.A11), gpio (P1.27)
PF6: cpu (U1.K2), gpio (P1.30)
PF7: cpu (U1.K1), gpio (P1.29)
PF11: cpu (U1.P8), gpio (P1.31)
PG3: cpu (U1.M12), gpio (P1.21)
PG6: cpu (U1.J15), gpio (P1.22)
PG7: cpu (U1.J14), gpio (P1.23)
PI0: cpu (U1.E14), gpio (P1.12)
PI1: cpu (U1.D14), gpio (P1.13)
PI2: cpu (U1.C14), gpio (P1.14)
PI3: cpu (U1.C13), gpio (P1.15)
PI4: cpu (U1.C3), gpio (P1.16)
PI5: cpu (U1.D3), gpio (P1.17)
PI6: cpu (U1.D6), gpio (P1.18)
PI7: cpu (U1.D4), gpio (P1.19)
PI8: cpu (U1.C2), gpio (P1.20)
QSPI_CLK: cpu (R9.2), quad_spi_flash (U6.6)
QSPI_D0: cpu (U1.N10), quad_spi_flash (U6.5)
QSPI_D1: cpu (U1.M10), quad_spi_flash (U6.2)
QSPI_D2: cpu (U1.A3), quad_spi_flash (U6.3)
QSPI_D3: cpu (U1.M11), quad_spi_flash (U6.7)
RMII_CRS_DV: cpu (U1.R3), Ethernet_PHY_RJ45 (R23.2)
RMII_MDC: cpu (U1.M3), Ethernet_PHY_RJ45 (U2.13)
RMII_MDIO: cpu (U1.P2), Ethernet_PHY_RJ45 (R29.2 U2.12)
RMII_REF_CLK: cpu (U1.N2), Ethernet_PHY_RJ45 (R20.1)
RMII_RXD0: cpu (U1.N5), Ethernet_PHY_RJ45 (R26.1)
RMII_RXD1: cpu (U1.P5), Ethernet_PHY_RJ45 (R27.1)
RMII_RXER: cpu (U1.M13), Ethernet_PHY_RJ45 (R28.2 U2.10)
RMII_TXD0: cpu (U1.B3), Ethernet_PHY_RJ45 (U2.17)
RMII_TXD1: cpu (U1.A4), Ethernet_PHY_RJ45 (U2.18)
RMII_TXEN: cpu (U1.B8), Ethernet_PHY_RJ45 (U2.16)
ULPI_CK: cpu (U1.P4), USB_OTG_HS_PHY (U12.1)
ULPI_D0: cpu (U1.R2), USB_OTG_HS_PHY (U12.3)
ULPI_D1: cpu (U1.R5), USB_OTG_HS_PHY (U12.4)
ULPI_D2: cpu (U1.R4), USB_OTG_HS_PHY (U12.5)
ULPI_D3: cpu (U1.P12), USB_OTG_HS_PHY (U12.6)
ULPI_D4: cpu (U1.R13), USB_OTG_HS_PHY (U12.7)
ULPI_D5: cpu (U1.L13), USB_OTG_HS_PHY (U12.9)
ULPI_D6: cpu (U1.K14), USB_OTG_HS_PHY (U12.10)
ULPI_D7: cpu (U1.A8), USB_OTG_HS_PHY (U12.13)
ULPI_DIR: cpu (U1.M4), USB_OTG_HS_PHY (U12.31)
ULPI_NXT: cpu (U1.H4), USB_OTG_HS_PHY (U12.2)
ULPI_STP: cpu (U1.M2), USB_OTG_HS_PHY (U12.29)
USART6_RX_PC7: cpu (U1.G15), gpio (P1.36)
USART6_TX_PC6: cpu (U1.H15), gpio (P1.37)
uSD_CLK: cpu (U1.A12), SD_CARD (J2.5)
uSD_CMD: cpu (U1.D12), SD_CARD (J2.3 R67.2)
uSD_D0: cpu (U1.G14), SD_CARD (J2.7 R68.2)
uSD_D1: cpu (U1.F14), SD_CARD (J2.8 R69.2)
uSD_D2: cpu (U1.B14), SD_CARD (J2.1 R65.2)
uSD_D3: cpu (U1.B13), SD_CARD (J2.2 R66.2)
uSD_Detect: cpu (U1.D1), SD_CARD (R63.1 R64.2)